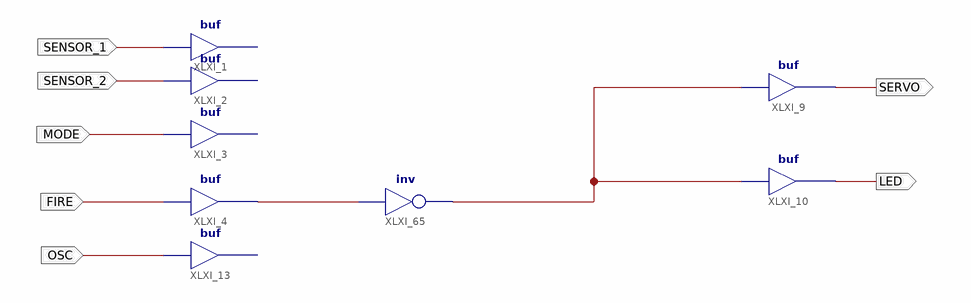
[diagram p0: schematic sheet 1]
// Xilinx ISE schematic bug_trap_controller.sch (zynq) as structural Verilog: 8 symbols, 7 ports
module bug_trap_controller (
  input  SENSOR_1,
  input  SENSOR_2,
  input  MODE,
  input  FIRE,
  input  OSC,
  output LED,
  output SERVO
);

  wire XLXN_140, XLXN_314;

  // buf XLXI_1 has open pins: I=SENSOR_1, O=open
  // buf XLXI_2 has open pins: I=SENSOR_2, O=open
  // buf XLXI_3 has open pins: I=MODE, O=open
  buf XLXI_4 (XLXN_140, FIRE);
  // buf XLXI_13 has open pins: I=OSC, O=open
  buf XLXI_10 (LED, XLXN_314);
  buf XLXI_9 (SERVO, XLXN_314);
  not XLXI_65 (XLXN_314, XLXN_140);
endmodule
